# Altium project 2018_Traco12V5A.PrjPcb
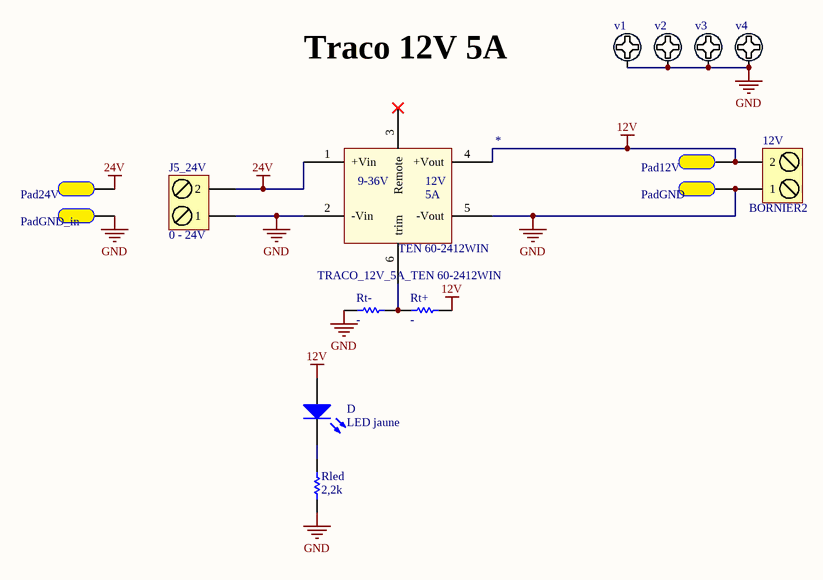
[diagram p0: 2018_Traco12V5A.SchDoc]
1 sheet, 15 parts. Net scope: global (net labels, ports and power ports of the same name join across sheets).
Board file: 2018_Traco12V5A.PcbDoc

## Sheet 2018_Traco12V5A.SchDoc
size A4

### Parts
12V  BORNIER2  [BORNIER2]
*  TRACO_12V_5A_TEN 60-2412WIN  [TRACO_TEN60]
D  LED jaune  [LED_0805]
J5_24V  0 - 24V  [BORNIER2_FEM_COUDE]
Pad12V  Pad_CMS  [PAD_CMS_5.08x2.54]  (value not drawn)
Pad24V  Pad_CMS  [PAD_CMS_5.08x2.54]  (value not drawn)
PadGND  Pad_CMS  [PAD_CMS_5.08x2.54]  (value not drawn)
PadGND_in  Pad_CMS  [PAD_CMS_5.08x2.54]  (value not drawn)
Rled  2,2k  [R1206_N]
Rt+  -  [R1206_N]
Rt-  -  [R1206_N]
v1  Pad_M3  [ENTRETOISE_CMS]  (value not drawn)
v2  Pad_M3  [ENTRETOISE_CMS]  (value not drawn)
v3  Pad_M3  [ENTRETOISE_CMS]  (value not drawn)
v4  Pad_M3  [ENTRETOISE_CMS]  (value not drawn)

### Nets
12V: 12V.2 *.4(+Vout) D.1(A) Pad12V.1 Rt+.1
24V: *.1(+Vin) J5_24V.2 Pad24V.1
GND: 12V.1 *.2(-Vin) *.5(-Vout) J5_24V.1 PadGND.1 PadGND_in.1 Rled.1 Rt-.2 v1.1 v2.1 v3.1 v4.1
Net*_6: *.6(trim) Rt+.2 Rt-.1
NetD_2: D.2(K) Rled.2

Not connected (* = marked no-connect by the designer): * 3(Remote)*

### Notes on the sheet
- Traco 12V 5A
- Title
- Size:
- Date:
- A4
- Number:
- Time:
- Revision:
- Sheet
- of
- File:
- (in symbol TRACO_12V_5A_TEN 60-2412WIN) 9-36V; 12V; 5A; TEN 60-2412WIN

### Library data of the parts
12V J5_24V = BORNIER2: Terminal blocks, 2 pins, pitch=5mm
D = LED: Typical LED; Published: 8-Jun-2000; LatestRevisionDate: 08-Jul-2005; LatestRevisionNote: Mech Layer 1 removed.; PackageReference: LED-1; Publisher: Altium Limited
Pad12V Pad24V PadGND PadGND_in = Pad_CMS: Pad pour souder un fil; LatestRevisionNote: Mech Layer 1 removed.; PackageReference: PAD_CMS; Publisher: Damien Guitton
Rled Rt+ Rt- = Resistor: Published: 8-Jun-2000; LatestRevisionDate: 17-Jul-2002; LatestRevisionNote: Re-released for DXP Platform.; PackageReference: AXIAL-0.5; Publisher: Altium Limited
v1-v4 = Vis M3 X 6mm _TORX_Tête 6mm: Publisher: Damien Guitton